# Altium schematic sheet main sheet.SchDoc
size A; SheetNumber: 1; SheetTotal: 3
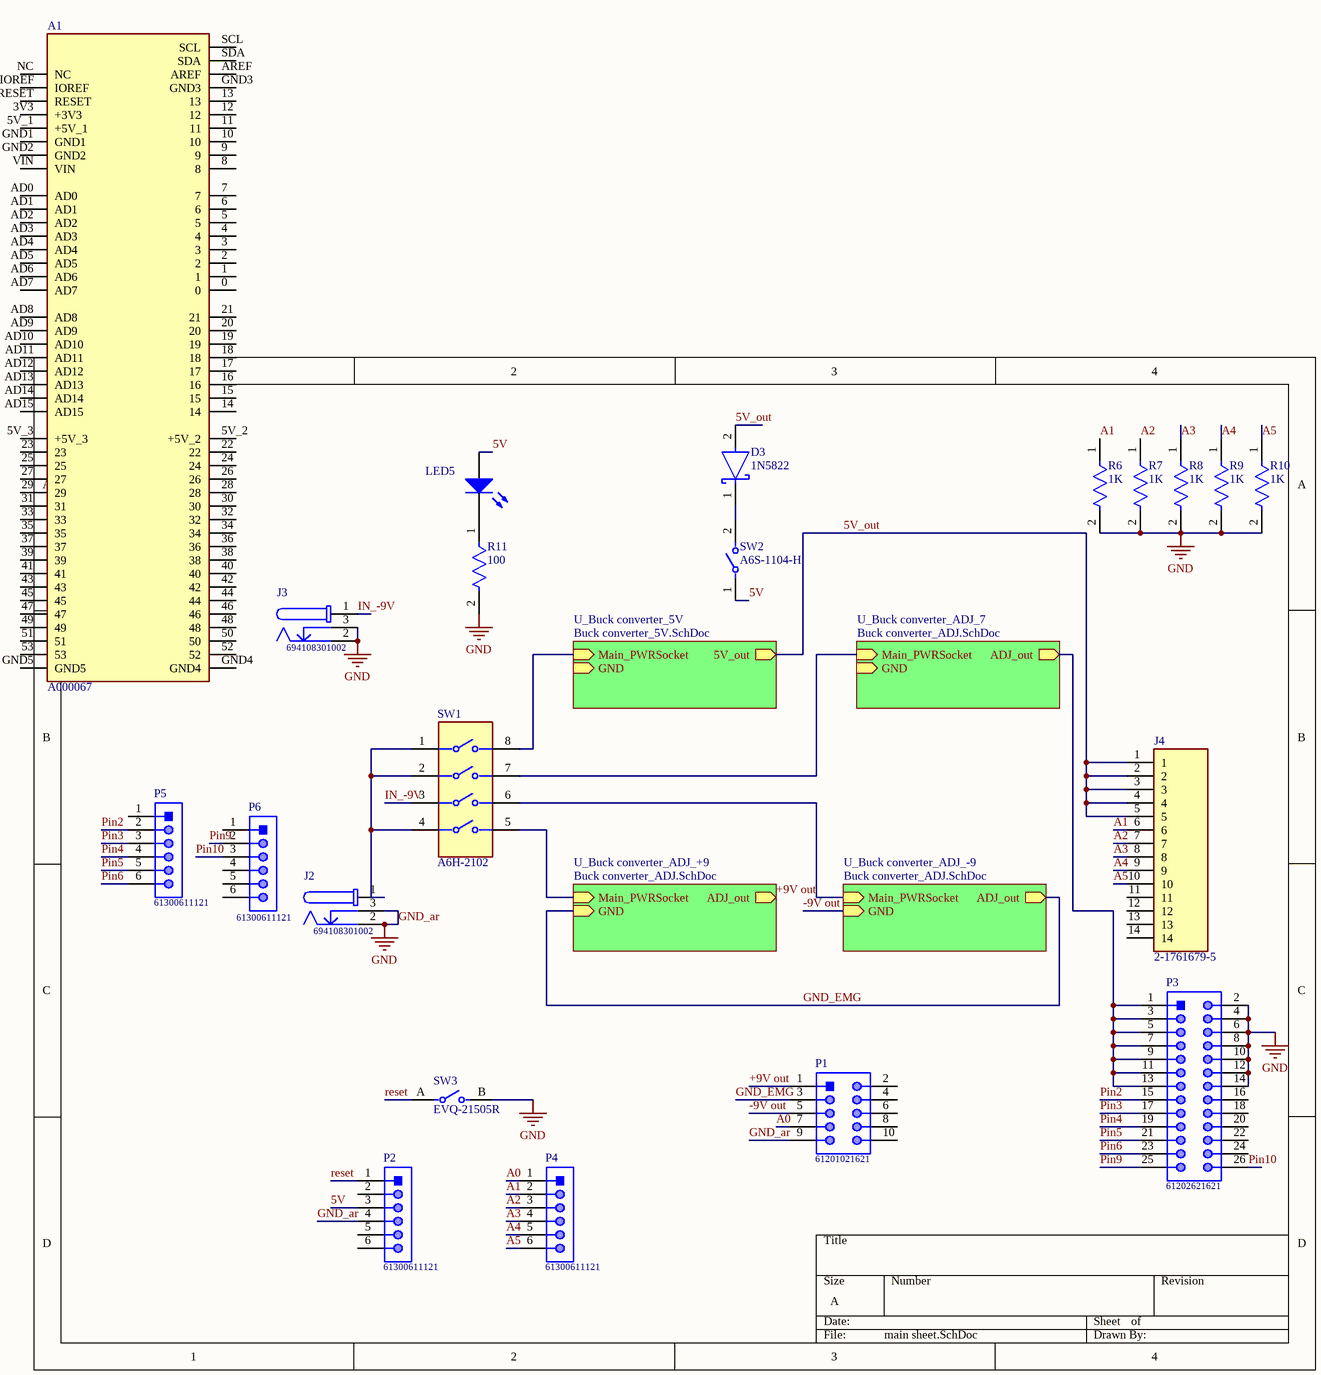
[diagram p0: main sheet.SchDoc]

## Parts
A1  A000067  [ARDUINO_A000067]
D3  1N5822  [FP-DO-201AD-MFG]
J2  694108301002  [694108301002]
J3  694108301002  [694108301002]
J4  2-1761679-5  [TE_2-1761679-5]
LED5  (no value)  [Type 5mm]
P1  61201021621  [61201021621]
P2  61300611121  [61300611121]
P3  61202621621  [61202621621]
P4  61300611121  [61300611121]
P5  61300611121  [61300611121]
P6  61300611121  [61300611121]
R6  value 1K  [FP-MFR-25-MFG]  (hidden comment: MFR-25FBF52-1K18)
R7  value 1K  [FP-MFR-25-MFG]  (hidden comment: MFR-25FBF52-1K18)
R8  value 1K  [FP-MFR-25-MFG]  (hidden comment: MFR-25FBF52-1K18)
R9  value 1K  [FP-MFR-25-MFG]  (hidden comment: MFR-25FBF52-1K18)
R10  value 1K  [FP-MFR-25-MFG]  (hidden comment: MFR-25FBF52-1K18)
R11  value 100  [FP-MFR-25-MFG]  (hidden comment: MFR-25FBF52-1K18)
SW1  A6H-2102  [FP-1825360-3-MFG]
SW2  A6S-1104-H  [FP-A6S-1104-H-MFG]
SW3  EVQ-21505R  [FP-EVQ-21505R-MFG]

## Sub-sheets
U_Buck converter_5V = Buck converter_5V.SchDoc: Main_PWRSocket (in), GND (in), 5V_out (out)
U_Buck converter_ADJ_7 = Buck converter_ADJ.SchDoc: Main_PWRSocket (in), GND (in), ADJ_out (out)
U_Buck converter_ADJ_+9 = Buck converter_ADJ.SchDoc: Main_PWRSocket (in), GND (in), ADJ_out (out)
U_Buck converter_ADJ_-9 = Buck converter_ADJ.SchDoc: Main_PWRSocket (in), GND (in), ADJ_out (out)

## Nets
GND_ar: J2.2 J2.3 J3.2 J3.3 P1.9 P2.4 P3.2 P3.4 P3.6 P3.8 P3.10 P3.12 P3.14 R6.2 R7.2 R8.2 R9.2 R10.2 R11.2 SW3.B  [also labelled GND]
5V: LED5.2(A) P2.3 SW2.1
5V_out: D3.2(A) J4.1 J4.2 J4.3 J4.4 J4.5 ; sheet U_Buck converter_5V/5V_out
+9V out: P1.1 ; sheet U_Buck converter_ADJ_+9/ADJ_out
-9V out: P1.5 ; sheet U_Buck converter_ADJ_-9/GND
A0: P1.7 P4.1
A1: J4.6 P4.2 R6.1
A2: J4.7 P4.3 R7.1
A3: J4.8 P4.4 R8.1
A4: J4.9 P4.5 R9.1
A5: J4.10 P4.6 R10.1
GND_EMG: P1.3 ; sheet U_Buck converter_ADJ_+9/GND, sheet U_Buck converter_ADJ_-9/ADJ_out
IN_-9V: J3.1 SW1.3
Pin2: P3.15 P5.2
Pin3: P3.17 P5.3
Pin4: P3.19 P5.4
Pin5: P3.21 P5.5
Pin6: P3.23 P5.6
Pin9: P3.25 P6.2
Pin10: P3.26 P6.3
reset: P2.1 SW3.A
NetD3_1: D3.1(C) SW2.2
NetJ2_1: J2.1 SW1.1 SW1.2 SW1.4
NetLED5_1: LED5.1(K) R11.1
NetP3_1: P3.1 P3.3 P3.5 P3.7 P3.9 P3.11 P3.13 ; sheet U_Buck converter_ADJ_7/ADJ_out
NetSW1_5: SW1.5 ; sheet U_Buck converter_ADJ_+9/Main_PWRSocket
NetSW1_6: SW1.6 ; sheet U_Buck converter_ADJ_-9/Main_PWRSocket
NetSW1_7: SW1.7 ; sheet U_Buck converter_ADJ_7/Main_PWRSocket
NetSW1_8: SW1.8 ; sheet U_Buck converter_5V/Main_PWRSocket

Not connected (* = marked no-connect by the designer): A1 0 1 2 3 3V3(+3V3) 4 5 5V_1(+5V_1) 5V_2(+5V_2) 5V_3(+5V_3) 6 7 8 9 10 11 12 13 14 15 16 17 18 19 20 21 22 23 24 25 26 27 28 29 30 31 32 33 34 35 36 37 38 39 40 41 42 43 44 45 46 47 48 49 50 51 52 53 AD0 AD1 AD2 AD3 AD4 AD5 AD6 AD7 AD8 AD9 AD10 AD11 AD12 AD13 AD14 AD15 AREF GND1 GND2 GND3 GND4 GND5 IOREF NC RESET SCL SDA VIN; J4 11 12 13 14; P1 2 4 6 8 10; P2 2 5 6; P3 16 18 20 22 24; P5 1; P6 1 4 5 6

## Library data of the parts
A1 = A000067: ARDUINO UNO REV3 DEVELOPMENT BOARD; MF: {'manufacturer': u'Arduino'}; Availability: Unavailable; Value: *; Price: None; MP: A000067; Package: None
D3 = CMP-12187-000025-1: DIODE SCHOTTKY 40V 3A DO201AD; Manufacturer: STMicroelectronics; Max Junction Temp: +150°C; Peak Reverse Current: 2mA; Max Surge Forward Current: 80A; Temperature Range High: +150°C; Automotive: No; RoHS: TRUE; ComponentLink2Description: Datasheet; Manufacturer Part Number: 1N5822; Lead Free: Yes; Octopart: https://octopart.com/1n5822-stmicroelectronics-323225; Device Class L2: Diodes; Max Repetitive Reverse Voltage: 40V; Temperature: to +150°C; Height: 5.3mm; Category: Diode; Digikey Description: DIODE SCHOTTKY 40V 3A DO201AD; ComponentLink2URL: https://www.st.com/resource/en/datasheet/1n5822.pdf; Device Class L3: Schottky Diodes; Device Class L1: Discrete Semiconductors; Forward Current: 3A; Mouser Description: Schottky Diodes & Rectifiers Vr/40V Io/3A BULK; Package: DO-201AD
J2 J3 = CMP-1502-00190-1: DC Power Jack Connector WR-DC, Male, Right Angled, THT, 5 A, 24 V; Manufacturer: Wurth Elektronik; Rated Current: 5A; Plug Inner Diameter: 2.55mm; Plug Outer Diameter: 5.5mm; Working Voltage: 24V; Opening Diameter: 6.4mm; Publisher: WurthElektronik; Orientation: RightAngled; Part Number: 694108301002; Manufacturer URL: http://www.we-online.de; Mounting Technology: THT; Packaging: Bag; Datasheet URL: http://katalog.we-online.de/em/datasheet/6941xx301002.pdf; Operating Temperature: -40to85degC; Package Reference: 694108301002; Gender: Male
J4 = 2-1761679-5: MF: {'manufacturer': u'TE Connectivity'}; MP: 2-1761679-5; Availability: Unavailable; Package: None; Value: *; Price: None
LED5 = CMP-1488-00007-1: THT LED round mono-color color lens, WL-TMRW, Bright Green; PartNumber: 151051VS04000; Manufacturer: Wuerth Elektronik; Emitting color: Bright Green; ComponentLink1Description: Manufacturer URL; PackageReference: Type 5mm; ComponentLink2URL: http://katalog.we-online.de/pbs/datasheet/7448042001.pdfhttp://katalog.we-online.de/pbs/datasheet/7448042001.pdfhttp://katalog.we-online.de/pbs/datasheet/7448042001.pdfhttp://katalog.we-online.de/pbs/datasheet/151051VS04000.pdf; ComponentLink1URL: http://www.we-online.com; ComponentLink2Description: Datasheet
P1 = CMP-1502-00007-1: Male Box Header WR-BHD, THT, Vertical, pitch 2.54 mm, 10 pins; Manufacturer: Wurth Elektronik; Contact Resistance: 20mOhm; Withstanding Voltage: 500VAC; Pin Number: 10; Working Voltage: 250VAC; Pitch: 2.54mm; Mounting Technology: THT; Operating Temperature: -40to125degC; Published Date: August2018; Gender: Male; Packaging: Tray; Manufacturer URL: http://www.we-online.de; Datasheet URL: https://katalog.we-online.de/em/datasheet/6120xx21621.pdf; Orientation: Vertical; Package Reference: 61201021621; Part Number: 61201021621; Publisher: WurthElektronik
P2 P4-P6 = CMP-1502-01070-1: THT Vertical Pin Header WR-PHD, Pitch 2.54 mm, Single Row, 6 pins; Manufacturer: Wurth Elektronik; Gender: Male; Pin Number: 6; Pitch: 2.54mm; Working Voltage: 250VAC; Rated Current: 3A; Withstanding Voltage: 500VAC; Contact Resistance: 20mOhm; Operating Temperature: -40to105degC; Packaging: Bag; Datasheet URL: https://katalog.we-online.de/em/datasheet/6130xx11121.pdf; Package Reference: 61300611121; Mounting Technology: THT; Publisher: WurthElektronik; Part Number: 61300611121; Manufacturer URL: http://www.we-online.de; Row Number: Single; Orientation: Vertical
P3 = CMP-1502-00012-1: Male Box Header WR-BHD, THT, Vertical, pitch 2.54 mm, 26 pins; Manufacturer: Wurth Elektronik; Pitch: 2.54mm; Working Voltage: 250VAC; Withstanding Voltage: 500VAC; Contact Resistance: 20mOhm; Pin Number: 26; Manufacturer URL: http://www.we-online.de; Datasheet URL: https://katalog.we-online.de/em/datasheet/6120xx21621.pdf; Operating Temperature: -40to125degC; Part Number: 61202621621; Published Date: August2018; Orientation: Vertical; Packaging: Tray; Mounting Technology: THT; Package Reference: 61202621621; Publisher: WurthElektronik; Gender: Male
R6-R11 = CMP-03413-000001-1: RES 1.18K OHM 1/4W 1% AXIAL; Manufacturer: Yageo; Temperature Coefficient: 100ppm/°C; Power Rating: 0.25W; Voltage Rating: 250V; Resistance: 10K Ω; Temperature: -55°C to +155°C; Automotive: No; Temperature Range High: +155°C; Mouser Description: Metal Film Resistors 1.18K OHM 1/4W 1%; Digikey Description: RES 1.18K OHM 1/4W 1% AXIAL; Lead Free: Yes; Tolerance: 1%; ComponentLink2Description: Datasheet; ComponentLink2URL: https://www.yageo.com/upload/media/product/products/datasheet/lr/Yageo_LR_MFR_1.pdf; Temperature Range Low: -55°C; Package: MFR-25; Ipc Land Pattern Name: RESAD1000W75L680D260; Composition: Metal Film; Category: Res; Octopart: https://octopart.com/mfr-25fbf52-1k18-yageo-56251681; Series: MFR; Device Class L2: Resistors; Height: 2.6mm; Device Class L3: Through-Hole Resistors; Manufacturer Part Number: MFR-25FBF52-1K18; RoHS: TRUE; Device Class L1: Passive Components
SW1 = CMP-03400-000022-1: SWITCH SLIDE DIP SPST 100MA 24V; Washable: Yes; Contact Current Rating: 1A; Electrical Life: 1000Cycles; Number of Circuits: 4; Pitch: 0.1inch; Actuator Length: 0.99mm; Contact Resistance: 50mR; Actuator Type: Standard; Contact Post Length: 4mm; Voltage Rating (DC): 5V; Actuator Material: Polybutylene; Sealable: No (Without); Max Voltage Rating (DC): 24V; Throw Configuration: SPST; Mount: Through Hole; Type: Switch; RoHS Compliant: Yes; Min Operating Temperature: -30°C; Max Operating Temperature: 85°C; Orientation: Straight; Packaging: Rail/Tube; Series: ADE; Lead Free: Lead Free; Depth: 7.49mm; Flammability Rating: UL94 V-0; Radiation Hardening: No; Terminal Pitch: 2.54mm; Package Quantity: 35; Contact Material: Copper Alloy; Housing Color: Black; Number of Positions: 4; Length: 0.476inch; ELV: Compliant; Termination: PC Pins; Housing Material: Polyphenylene; Contact Plating: Gold; Max Current Rating: 100mA; Height: 0.138inch
SW2 = CMP-08827-000005-1: SWITCH SLIDE DIP SPST 25MA 24V; Manufacturer: Omron Electronics Inc-EMC Div; Throw Configuration: SPST-NO; Standoff Height: 0mm; Number Of Circuits: 1; Electromechanical Life: 1000Cycles; Contact Resistance: 200mΩ; Digikey Description: SWITCH SLIDE DIP SPST 25MA 24V; ComponentLink2Description: Datasheet; Mount: Surface Mount; Manufacturer Part Number: A6S-1104-H; ComponentLink2URL: https://omronfs.omron.com/en_US/ecb/products/pdf/en-a6s.pdf; Category: Switch; Height: 3.95mm; Device Class L3: DIP Switches; Octopart: https://octopart.com/a6s-1104-h-omron-55410938; Mouser Description: DIP Switches / SIP Switches Dip Switch; Lead Free: Yes; Temperature Range Low: -20°C; Temperature Range High: +70°C; Automotive: No; Ambient Temperature Range Low: -20°C; Ambient Temperature Range High: +70°C; Voltage Rating Dc: 24V; Device Class L2: Switches; RoHS: TRUE; Package: 0; Contact Current Rating: 25mA; Device Class L1: Electromechanical; Temperature: -20°C to +70°C
SW3 = CMP-05618-000118-1: SWITCH TACTILE SPST-NO 0.02A 15V; Actuator Length: 1.6mm; Contact Current Rating: 20mA; Actuator Type: Standard; Operating Force: 1.6N; Switch Function: Off-Mom; Mechanical Life: 100000Cycles; Illumination Type: Non-Illuminated; Contact Resistance: 50mR; Actuator Color: Red; Throw Configuration: SPST; Switch Travel: 0.25mm; Termination: PC Pin; Package Quantity: 1; Lead Free: Lead Free; Orientation: Straight; Packaging: Tape and Reel; Series: EVQ2; Min Operating Temperature: -20°C; Max Operating Temperature: 70°C; Width: 6mm; Voltage Rating (DC): 15V; Current Rating: 20mA; Depth: 6mm; Height: 5mm; Contact Plating: Silver; Electrical Life: 100000Cycles; Mount: Through Hole; Max Voltage Rating (DC): 15V; Max Current Rating: 20mA; Length: 6mm; Size: 6mm; Case/Package: Radial